# EAGLE design breakout (EAGLE 7.1.0)
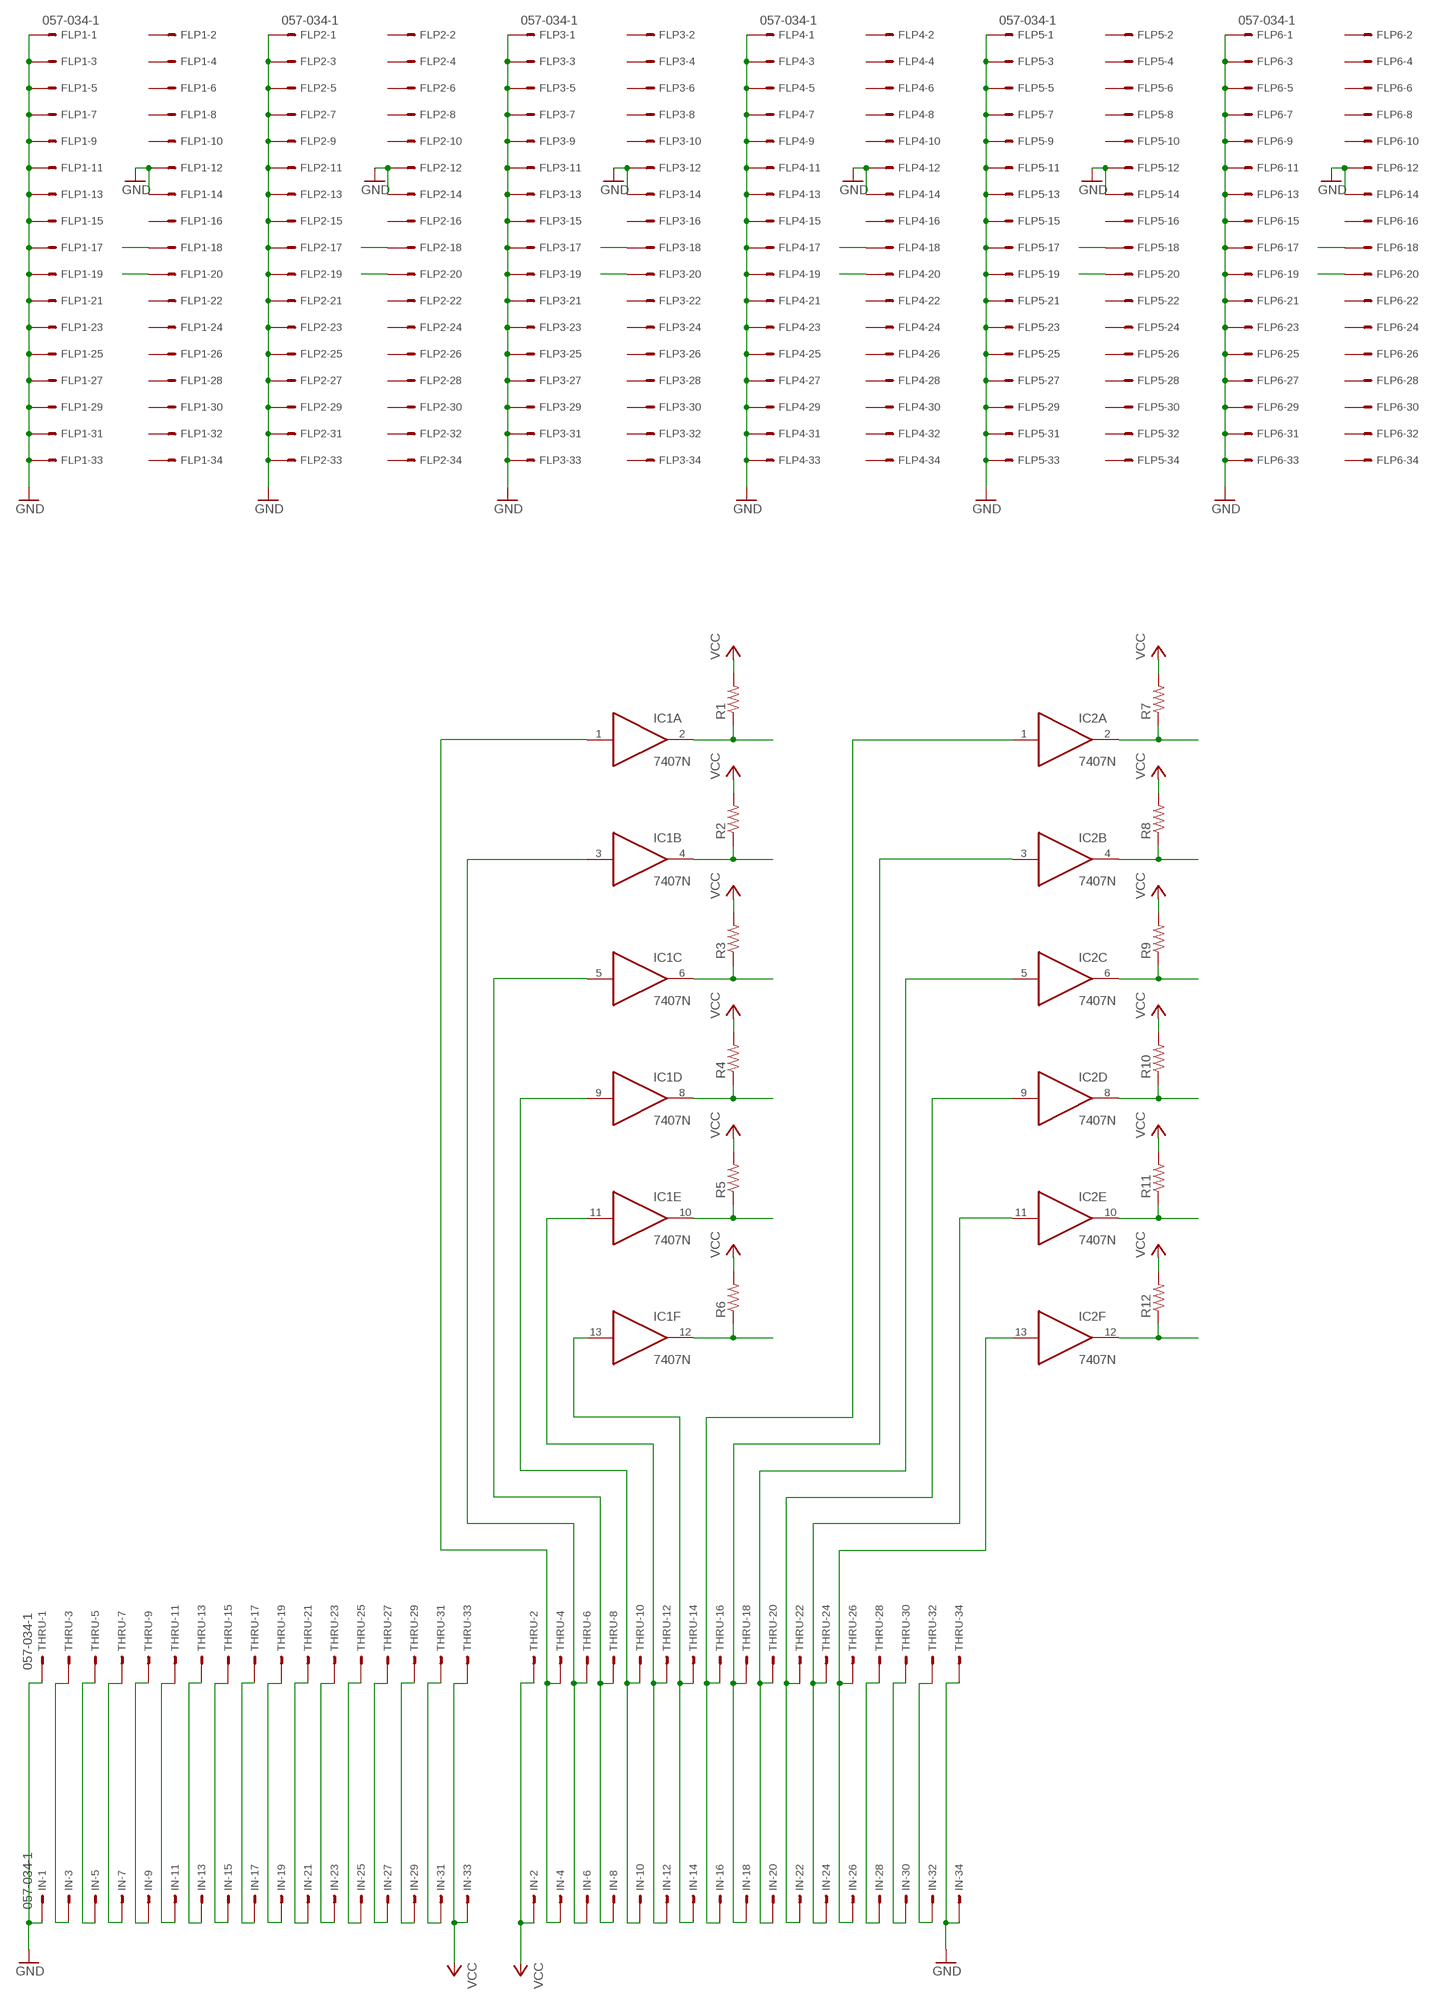
[diagram p0: schematic, sheet 1]

## Parts
FLP1  057-034-1  [057-034-1]
FLP2  057-034-1  [057-034-1]
FLP3  057-034-1  [057-034-1]
FLP4  057-034-1  [057-034-1]
FLP5  057-034-1  [057-034-1]
FLP6  057-034-1  [057-034-1]
IC1  7407N  [DIL14]
IC2  7407N  [DIL14]
IN  057-034-1  [057-034-1]
R1  R-US_0204/7  [0204/7]
R2  R-US_0204/7  [0204/7]
R3  R-US_0204/7  [0204/7]
R4  R-US_0204/7  [0204/7]
R5  R-US_0204/7  [0204/7]
R6  R-US_0204/7  [0204/7]
R7  R-US_0204/7  [0204/7]
R8  R-US_0204/7  [0204/7]
R9  R-US_0204/7  [0204/7]
R10  R-US_0204/7  [0204/7]
R11  R-US_0204/7  [0204/7]
R12  R-US_0204/7  [0204/7]
THRU  057-034-1  [057-034-1]

## Nets
DIRECTION_1: FLP1.18 IC1.2(A:O) R1.1
DIRECTION_2: FLP2.18 IC1.6(C:O) R3.1
DIRECTION_3: FLP3.18 IC1.10(E:O) R5.1
DIRECTION_4: FLP4.18 IC2.2(A:O) R7.1
DIRECTION_5: FLP5.18 IC2.6(C:O) R9.1
DIRECTION_6: FLP6.18 IC2.10(E:O) R11.1
GND: FLP1.1 FLP1.3 FLP1.5 FLP1.7 FLP1.9 FLP1.11 FLP1.12 FLP1.13 FLP1.14 FLP1.15 FLP1.17 FLP1.19 FLP1.21 FLP1.23 FLP1.25 FLP1.27 FLP1.29 FLP1.31 FLP1.33 FLP2.1 FLP2.3 FLP2.5 FLP2.7 FLP2.9 FLP2.11 FLP2.12 FLP2.13 FLP2.14 FLP2.15 FLP2.17 FLP2.19 FLP2.21 FLP2.23 FLP2.25 FLP2.27 FLP2.29 FLP2.31 FLP2.33 FLP3.1 FLP3.3 FLP3.5 FLP3.7 FLP3.9 FLP3.11 FLP3.12 FLP3.13 FLP3.14 FLP3.15 FLP3.17 FLP3.19 FLP3.21 FLP3.23 FLP3.25 FLP3.27 FLP3.29 FLP3.31 FLP3.33 FLP4.1 FLP4.3 FLP4.5 FLP4.7 FLP4.9 FLP4.11 FLP4.12 FLP4.13 FLP4.14 FLP4.15 FLP4.17 FLP4.19 FLP4.21 FLP4.23 FLP4.25 FLP4.27 FLP4.29 FLP4.31 FLP4.33 FLP5.1 FLP5.3 FLP5.5 FLP5.7 FLP5.9 FLP5.11 FLP5.12 FLP5.13 FLP5.14 FLP5.15 FLP5.17 FLP5.19 FLP5.21 FLP5.23 FLP5.25 FLP5.27 FLP5.29 FLP5.31 FLP5.33 FLP6.1 FLP6.3 FLP6.5 FLP6.7 FLP6.9 FLP6.11 FLP6.12 FLP6.13 FLP6.14 FLP6.15 FLP6.17 FLP6.19 FLP6.21 FLP6.23 FLP6.25 FLP6.27 FLP6.29 FLP6.31 FLP6.33 IN.1 IN.34 THRU.1 THRU.34
N$34: IC1.1(A:I) IN.4 THRU.4
N$35: IC1.3(B:I) IN.6 THRU.6
N$36: IC1.5(C:I) IN.8 THRU.8
N$37: IC1.9(D:I) IN.10 THRU.10
N$38: IC1.11(E:I) IN.12 THRU.12
N$39: IC1.13(F:I) IN.14 THRU.14
N$40: IC2.1(A:I) IN.16 THRU.16
N$41: IC2.3(B:I) IN.18 THRU.18
N$42: IC2.5(C:I) IN.20 THRU.20
N$43: IC2.9(D:I) IN.22 THRU.22
N$44: IC2.11(E:I) IN.24 THRU.24
N$45: IC2.13(F:I) IN.26 THRU.26
N$46: IN.28 THRU.28
N$47: IN.30 THRU.30
N$48: IN.32 THRU.32
N$51: IN.3 THRU.3
N$52: IN.5 THRU.5
N$53: IN.7 THRU.7
N$54: IN.9 THRU.9
N$55: IN.11 THRU.11
N$56: IN.13 THRU.13
N$57: IN.15 THRU.15
N$58: IN.17 THRU.17
N$59: IN.19 THRU.19
N$60: IN.21 THRU.21
N$61: IN.23 THRU.23
N$62: IN.25 THRU.25
N$63: IN.27 THRU.27
N$64: IN.29 THRU.29
N$65: IN.31 THRU.31
STEP_1: FLP1.20 IC1.4(B:O) R2.1
STEP_2: FLP2.20 IC1.8(D:O) R4.1
STEP_3: FLP3.20 IC1.12(F:O) R6.1
STEP_4: FLP4.20 IC2.4(B:O) R8.1
STEP_5: FLP5.20 IC2.8(D:O) R10.1
STEP_6: FLP6.20 IC2.12(F:O) R12.1
VCC: IN.2 IN.33 R1.2 R2.2 R3.2 R4.2 R5.2 R6.2 R7.2 R8.2 R9.2 R10.2 R11.2 R12.2 THRU.2 THRU.33
Unconnected: FLP1.2 FLP1.4 FLP1.6 FLP1.8 FLP1.10 FLP1.16 FLP1.22 FLP1.24 FLP1.26 FLP1.28 FLP1.30 FLP1.32 FLP1.34 FLP2.2 FLP2.4 FLP2.6 FLP2.8 FLP2.10 FLP2.16 FLP2.22 FLP2.24 FLP2.26 FLP2.28 FLP2.30 FLP2.32 FLP2.34 FLP3.2 FLP3.4 FLP3.6 FLP3.8 FLP3.10 FLP3.16 FLP3.22 FLP3.24 FLP3.26 FLP3.28 FLP3.30 FLP3.32 FLP3.34 FLP4.2 FLP4.4 FLP4.6 FLP4.8 FLP4.10 FLP4.16 FLP4.22 FLP4.24 FLP4.26 FLP4.28 FLP4.30 FLP4.32 FLP4.34 FLP5.2 FLP5.4 FLP5.6 FLP5.8 FLP5.10 FLP5.16 FLP5.22 FLP5.24 FLP5.26 FLP5.28 FLP5.30 FLP5.32 FLP5.34 FLP6.2 FLP6.4 FLP6.6 FLP6.8 FLP6.10 FLP6.16 FLP6.22 FLP6.24 FLP6.26 FLP6.28 FLP6.30 FLP6.32 FLP6.34

## Power pins joined to a net without a drawn wire
GND: IC1.7(P:GND) IC2.7(P:GND)
VCC: IC1.14(P:VCC) IC2.14(P:VCC)

## Library data of the parts
FLP1-FLP6 IN THRU = con-panduit:057-034-: CONNECTOR 34-pin series 057 contact pc board low profile headers; OC_FARNELL: unknown; OC_NEWARK: unknown
IC1 IC2 = 74xx-us:74*07: Hex BUFFER, open collector high-voltage output
R1-R12 = resistor:R-US_: RESISTOR, American symbol

## Board
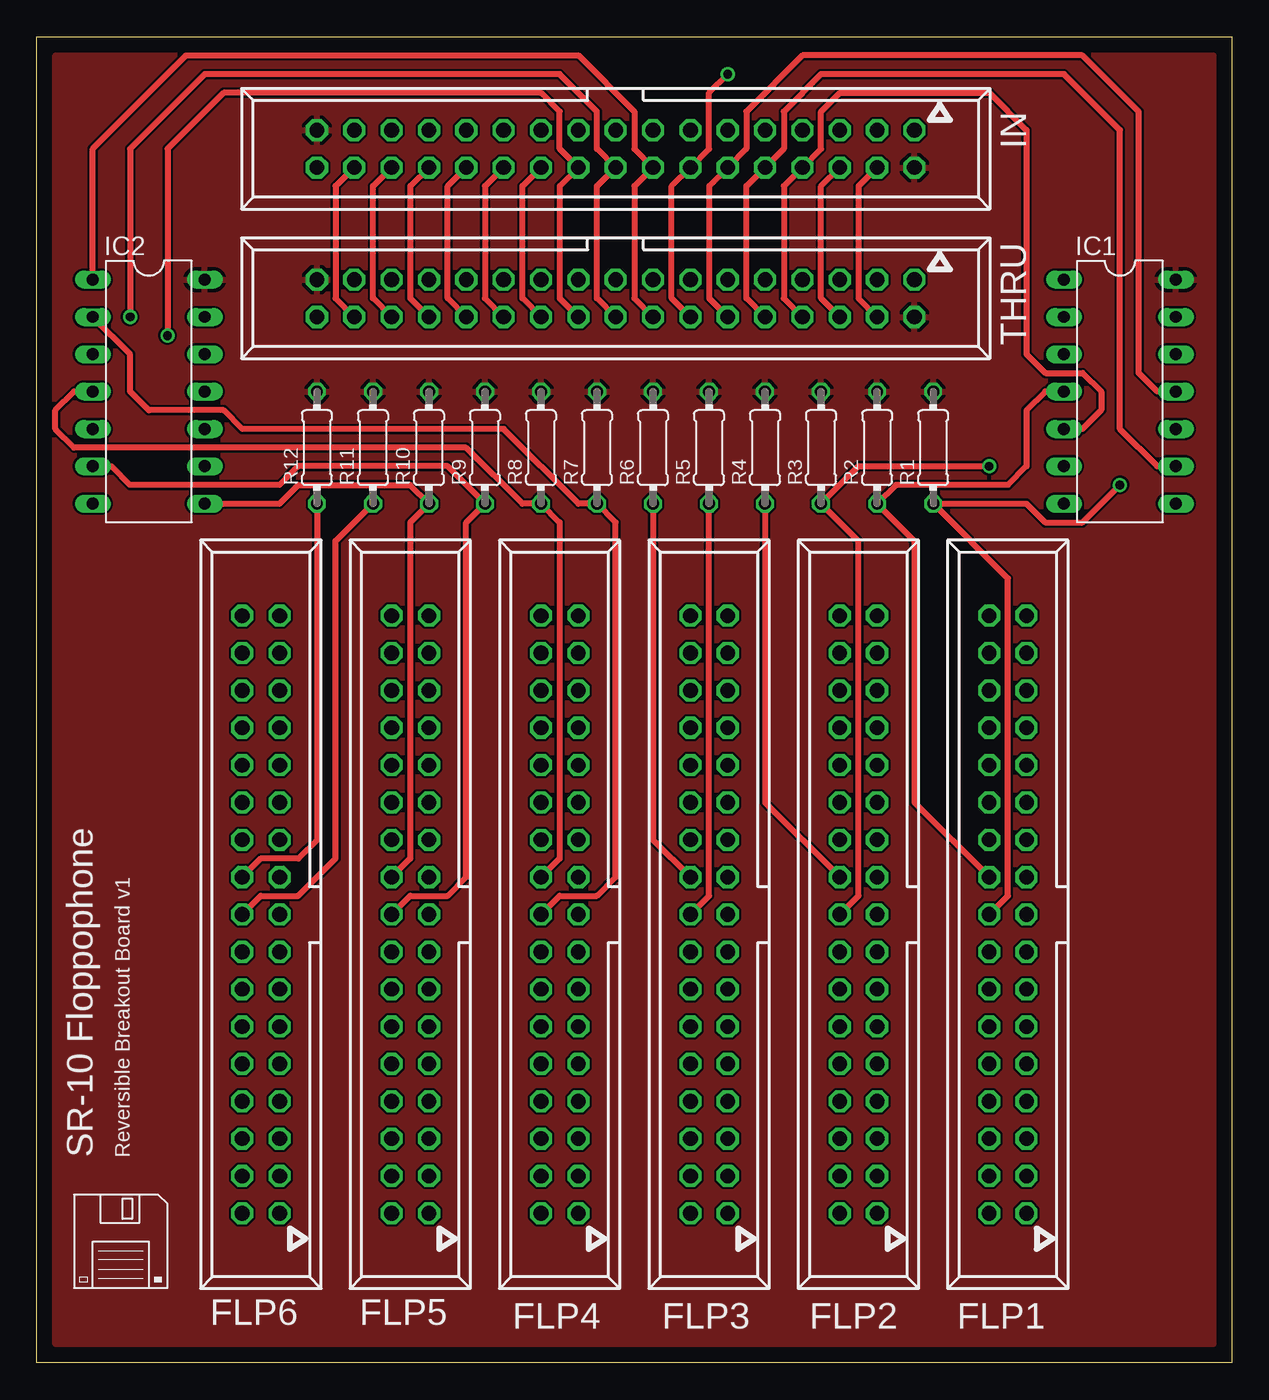
[diagram p1: board, top side]
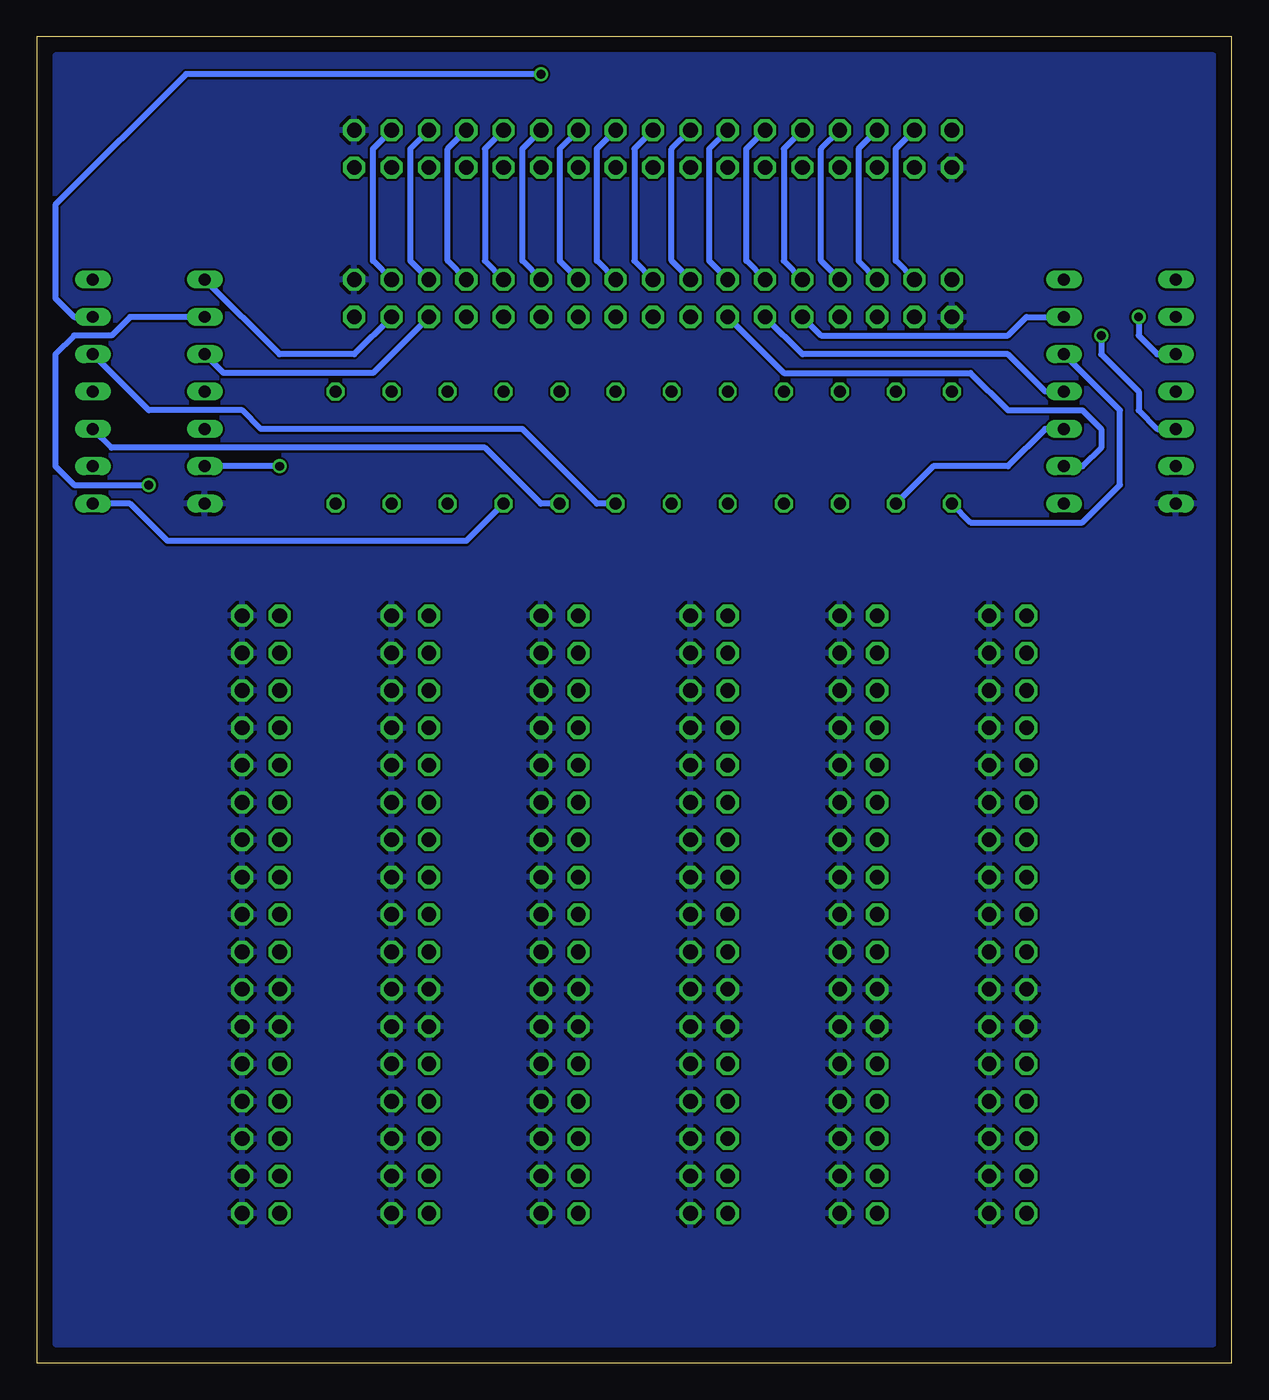
[diagram p2: board, bottom side, seen from below]

Size 81.28 x 90.17 mm. Coordinates in mm from the lower left corner, seen from the top.
Outline: 0,0 0,90.17 81.28,90.17 81.28,0 0,0
Copper layers (1*16): Top 0.0356mm / dielectric 1.5011mm / Bottom 0.0356mm
Design rules "OSHPark": minimum track width 6mil, minimum drill 13mil, track to track 6mil, track to pad 6mil, pad to pad 6mil, via to via 6mil, smd to smd 6mil, copper to edge 15mil, drill to drill 6mil, minimum pad ring 7mil, minimum via ring 7mil, stop-mask expansion 3mil, vias tented up to drill 0mil, thermal gap 10mil

### Footprints (pad centres in the part's own frame; a part is rotated, then mirrored left to right if it is on the bottom)
057-034-1 = drill 1 octagon: 1 -20.32,-1.27; 2 -20.32,1.27; 3 -17.78,-1.27; 4 -17.78,1.27; 5 -15.24,-1.27; 6 -15.24,1.27; 7 -12.7,-1.27; 8 -12.7,1.27; 9 -10.16,-1.27; 10 -10.16,1.27; 11 -7.62,-1.27; 12 -7.62,1.27; 13 -5.08,-1.27; 14 -5.08,1.27; 15 -2.54,-1.27; 16 -2.54,1.27; 17 0,-1.27; 18 0,1.27; 19 2.54,-1.27; 20 2.54,1.27; 21 5.08,-1.27; 22 5.08,1.27; 23 7.62,-1.27; 24 7.62,1.27; 25 10.16,-1.27; 26 10.16,1.27; 27 12.7,-1.27; 28 12.7,1.27; 29 15.24,-1.27; 30 15.24,1.27; 31 17.78,-1.27; 32 17.78,1.27; 33 20.32,-1.27; 34 20.32,1.27
DIL14 = drill 0.813 long: 1 -7.62,-3.81; 2 -5.08,-3.81; 3 -2.54,-3.81; 4 0,-3.81; 5 2.54,-3.81; 6 5.08,-3.81; 7 7.62,-3.81; 8 7.62,3.81; 9 5.08,3.81; 10 2.54,3.81; 11 0,3.81; 12 -2.54,3.81; 13 -5.08,3.81; 14 -7.62,3.81
0204/7 = drill 0.813 octagon: 1 -3.81,0; 2 3.81,0

### Placement (x,y rotation side)
FLP1  66.04,30.48 90 top
FLP2  55.88,30.48 90 top
FLP3  45.72,30.48 90 top
FLP4  35.56,30.48 90 top
FLP5  25.4,30.48 90 top
FLP6  15.24,30.48 90 top
IC1  73.66,66.04 270 top
IC2  7.62,66.04 270 top
IN  39.37,82.55 180 top
R1  60.96,62.23 90 top
R2  57.15,62.23 90 top
R3  53.34,62.23 90 top
R4  49.53,62.23 90 top
R5  45.72,62.23 90 top
R6  41.91,62.23 90 top
R7  38.1,62.23 90 top
R8  34.29,62.23 90 top
R9  30.48,62.23 90 top
R10  26.67,62.23 90 top
R11  22.86,62.23 90 top
R12  19.05,62.23 90 top
THRU  39.37,72.39 180 top

### Tracks (layer width: path | path; a pad name or v marks a point on that pad's centre or on a via)
DIRECTION_1  (via drill 0.6)
  Top 0.406: FLP1.18 66.04,31.75 66.04,53.34 R1.1 67.31,58.42 68.58,57.15 71.12,57.15 v73.66,59.69
  Bottom 0.406: IC1.2 74.93,71.12 76.2,69.85 78.74,69.85 80.01,68.58 80.01,60.96 78.74,59.69 v73.66,59.69
DIRECTION_2  (via drill 0.6)
  Top 0.406: FLP2.18 55.88,31.75 55.88,55.88 R3.1 55.88,60.96 v64.77,60.96
  Bottom 0.406: v64.77,60.96 IC1.6
DIRECTION_3
  Top 0.406: FLP3.18 45.72,31.75 R5.1
  Bottom 0.406: R5.1 46.99,58.42 50.8,62.23 76.2,62.23 IC1.10
DIRECTION_4
  Top 0.406: FLP4.18 35.56,31.75 38.1,31.75 39.37,33.02 39.37,57.15 R7.1 36.83,58.42 31.75,63.5 13.97,63.5 12.7,64.77 7.62,64.77 6.35,66.04 6.35,68.58 IC2.2
DIRECTION_5
  Top 0.406: FLP5.18 25.4,31.75 27.94,31.75 29.21,33.02 29.21,57.15 R9.1 27.94,60.96 17.78,60.96 16.51,59.69 6.35,59.69 5.08,60.96 IC2.6
DIRECTION_6
  Top 0.406: FLP6.18 15.24,31.75 17.78,31.75 20.32,34.29 20.32,55.88 R11.1
  Bottom 0.406: IC2.10 12.7,63.5 15.24,60.96 20.32,60.96 R11.1
GND
  pour Bottom: 1.27,1.27 1.27,88.9 80.01,88.9 80.01,1.27
N$34
  Top 0.406: IN.4 55.88,80.01 55.88,72.39 THRU.4
  Bottom 0.406: THRU.4 59.69,68.58 64.77,68.58 IC1.1
N$35
  Top 0.406: THRU.6 53.34,72.39 53.34,80.01 IN.6
  Bottom 0.406: THRU.6 58.42,67.31 68.58,67.31 IC1.3
N$36
  Top 0.406: THRU.8 50.8,72.39 50.8,80.01 IN.8 53.34,82.55 53.34,85.09 54.61,86.36 64.77,86.36 67.31,83.82 67.31,68.58 68.58,67.31 71.12,67.31 72.39,66.04 72.39,64.77 71.12,63.5 IC1.5
N$37
  Top 0.406: THRU.10 48.26,72.39 48.26,80.01 IN.10 50.8,82.55 50.8,85.09 53.34,87.63 69.85,87.63 73.66,83.82 73.66,63.5 76.2,60.96 IC1.9
N$38
  Top 0.406: THRU.12 45.72,72.39 45.72,80.01 IN.12 48.26,82.55 48.26,85.09 52.07,88.9 71.12,88.9 74.93,85.09 74.93,67.31 76.2,66.04 IC1.11
N$39  (via drill 0.6)
  Top 0.406: THRU.14 43.18,72.39 43.18,80.01 IN.14 45.72,82.55 45.72,86.36 v46.99,87.63
  Bottom 0.406: v46.99,87.63 71.12,87.63 80.01,78.74 80.01,72.39 78.74,71.12 IC1.13
N$40
  Top 0.406: THRU.16 40.64,72.39 40.64,80.01 IN.16 40.64,82.55 40.64,85.09 36.83,88.9 10.16,88.9 3.81,82.55 IC2.1
N$41  (via drill 0.6)
  Top 0.406: THRU.18 38.1,72.39 38.1,80.01 IN.18 38.1,82.55 38.1,85.09 35.56,87.63 11.43,87.63 6.35,82.55 v6.35,71.12
  Bottom 0.406: v6.35,71.12 6.35,69.85 5.08,68.58 IC2.3
N$42  (via drill 0.6)
  Top 0.406: THRU.20 35.56,72.39 35.56,80.01 IN.20 35.56,82.55 35.56,85.09 34.29,86.36 12.7,86.36 8.89,82.55 v8.89,69.85
  Bottom 0.406: v8.89,69.85 8.89,68.58 6.35,66.04 6.35,64.77 5.08,63.5 IC2.5
N$43
  Top 0.406: THRU.22 33.02,72.39 33.02,80.01 IN.22
  Bottom 0.406: THRU.22 30.48,67.31 17.78,67.31 15.24,64.77 10.16,64.77 8.89,63.5 8.89,62.23 10.16,60.96 IC2.9
N$44
  Top 0.406: IN.24 30.48,80.01 30.48,72.39 THRU.24
  Bottom 0.406: IC2.11 12.7,66.04 15.24,68.58 29.21,68.58 THRU.24
N$45
  Top 0.406: THRU.26 27.94,72.39 27.94,80.01 IN.26
  Bottom 0.406: THRU.26 27.94,69.85 15.24,69.85 13.97,71.12 IC2.13
N$46
  Top 0.406: IN.28 25.4,80.01 25.4,72.39 THRU.28
N$47
  Top 0.406: THRU.30 22.86,72.39 22.86,80.01 IN.30
N$48
  Top 0.406: IN.32 20.32,80.01 20.32,72.39 THRU.32
N$51
  Bottom 0.406: THRU.3 58.42,74.93 58.42,82.55 IN.3
N$52
  Bottom 0.406: IN.5 55.88,82.55 55.88,74.93 THRU.5
N$53
  Bottom 0.406: THRU.7 53.34,74.93 53.34,82.55 IN.7
N$54
  Bottom 0.406: IN.9 50.8,82.55 50.8,74.93 THRU.9
N$55
  Bottom 0.406: THRU.11 48.26,74.93 48.26,82.55 IN.11
N$56
  Bottom 0.406: IN.13 45.72,82.55 45.72,74.93 THRU.13
N$57
  Bottom 0.406: THRU.15 43.18,74.93 43.18,82.55 IN.15
N$58
  Bottom 0.406: IN.17 40.64,82.55 40.64,74.93 THRU.17
N$59
  Bottom 0.406: THRU.19 38.1,74.93 38.1,82.55 IN.19
N$60
  Bottom 0.406: IN.21 35.56,82.55 35.56,74.93 THRU.21
N$61
  Bottom 0.406: THRU.23 33.02,74.93 33.02,82.55 IN.23
N$62
  Bottom 0.406: IN.25 30.48,82.55 30.48,74.93 THRU.25
N$63
  Bottom 0.406: THRU.27 27.94,74.93 27.94,82.55 IN.27
N$64
  Bottom 0.406: IN.29 25.4,82.55 25.4,74.93 THRU.29
N$65
  Bottom 0.406: THRU.31 22.86,74.93 22.86,82.55 IN.31
STEP_1
  Top 0.406: FLP1.20 59.69,38.1 59.69,55.88 R2.1 58.42,59.69 66.04,59.69 67.31,60.96 67.31,64.77 68.58,66.04 IC1.4
STEP_2
  Top 0.406: R4.1 49.53,38.1 FLP2.20
  Bottom 0.406: R4.1 52.07,55.88 72.39,55.88 74.93,58.42 IC1.8
STEP_3
  Top 0.406: R6.1 41.91,35.56 FLP3.20
  Bottom 0.406: R6.1 43.18,58.42 48.26,63.5 66.04,63.5 67.31,64.77 73.66,64.77 IC1.12
STEP_4
  Top 0.406: FLP4.20 35.56,34.29 35.56,57.15 R8.1 33.02,58.42 29.21,62.23 2.54,62.23 1.27,63.5 1.27,64.77 2.54,66.04 IC2.4
STEP_5
  Top 0.406: FLP5.20 25.4,34.29 25.4,57.15 R10.1 25.4,59.69 17.78,59.69 16.51,58.42 IC2.8
STEP_6
  Top 0.406: R12.1 19.05,35.56 17.78,34.29 15.24,34.29 FLP6.20
  Bottom 0.406: R12.1 17.78,57.15 10.16,57.15 7.62,59.69 7.62,64.77 IC2.12
VCC
  pour Top: 1.27,1.27 1.27,88.9 80.01,88.9 80.01,1.27

### Text on the board
tNames: SR-10 Floppophone | Reversible Breakout Board v1